# EAGLE schematic EnchantedCottage (EAGLE 7.2.0)
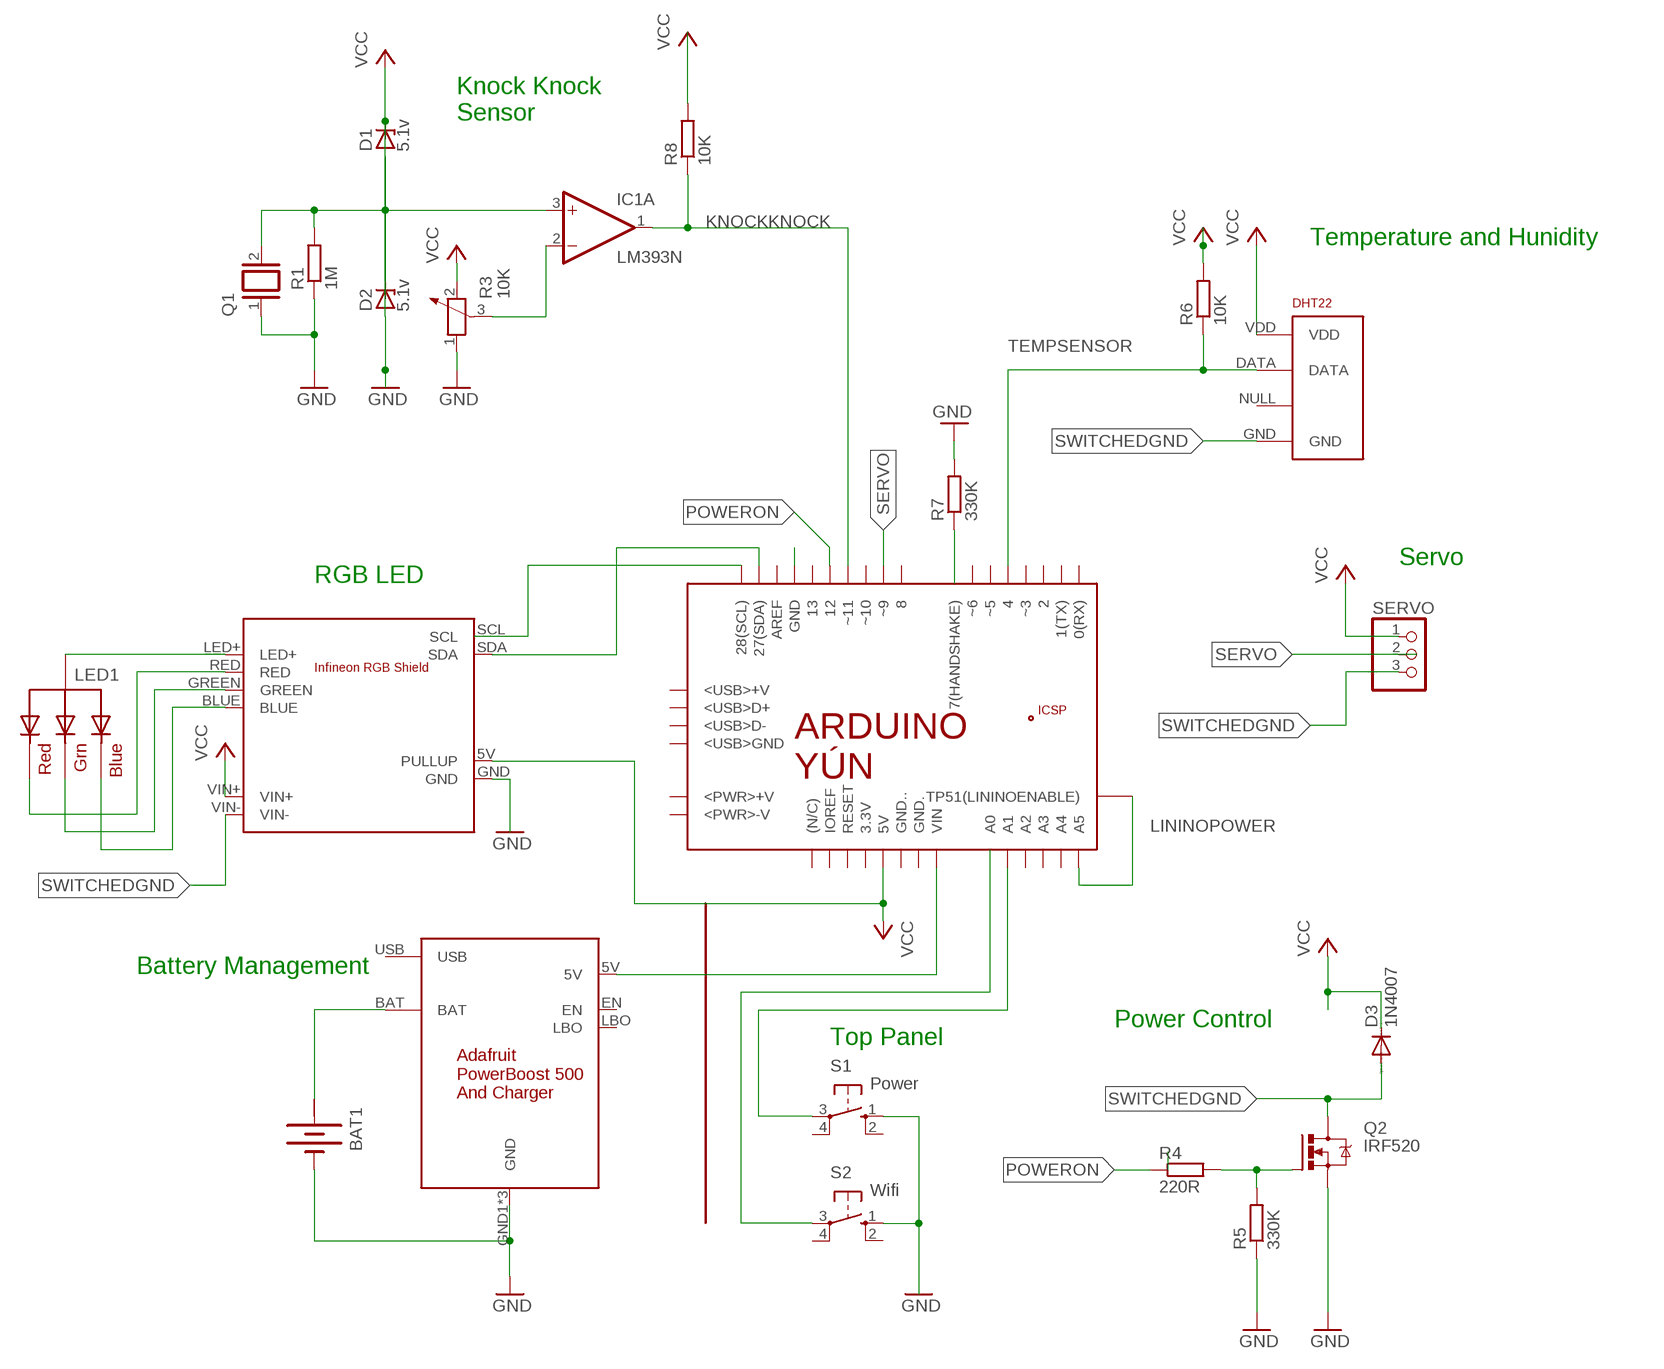
[diagram p0: schematic, sheet 1]

## Parts
BAT1  BATTERY  [BATTERY]
D1  5.1v  BZX55  [DO35Z10]
D2  5.1v  BZX55  [DO35Z10]
D3  1N4007  DIODE-C1702-15  [C1702-15]
DHT22  RHT03_DHT-22_AM2302  [RHT03_DHT-22]
IC1  LM393N  [DIL08]
LED1  RGBLED_CA-5MM  [LED5MMRGB]
PCB1  ARDUINO_YUN_EXT  (no package)
Q1  XTAL/S  [QS]
Q2  IRF520  [TO220BV]
R1  1M  R-EU_0204/7  [0204/7]
R3  10K  POTENTIOMETER_PT-10  [PT-10]
R4  220R  R-EU_0207/12  [0207/12]
R5  330K  R-EU_0207/12  [0207/12]
R6  10K  R-EU_0204/7  [0204/7]
R7  330K  R-EU_0204/7  [0204/7]
R8  10K  R-EU_0204/7  [0204/7]
S1  Power  10-XX  [B3F-10XX]
S2  Wifi  10-XX  [B3F-10XX]
SERVO  PINHD-1X3  [1X03]
U$1  POWERBOOST500  [PINS]
U$2  RGBSHIELD  [RGBSHIELD]

## Nets
GND: BAT1.- Q1.1 Q2.S R1.1 R3.1 R5.1 R7.2 S1.1(S) S2.1(S) U$1.GND1(GND) U$1.GND2(GND) U$1.GND3(GND)
KNOCKKNOCK: IC1.1(A:OUT) PCB1.~11 R8.1
LININOPOWER: PCB1.A5 PCB1.TP51(LININOENABLE)
N$1: IC1.2(A:-IN) R3.3
N$2: R7.1
N$3: D1.A D2.C IC1.3(A:+IN) Q1.2 R1.2
N$4: Q2.G R4.2 R5.2
N$5: PCB1.VIN U$1.5V
N$7: R6.2 ; supply symbol labelled VCC
N$8: BAT1.+ U$1.BAT
N$9: LED1.2(VCC) U$2.LED+
N$10: LED1.1(RED) U$2.RED
N$11: LED1.3(GREEN) U$2.GREEN
N$12: LED1.4(BLUE) U$2.BLUE
N$13: R8.2
N$14: U$2.GND
N$15: PCB1.27(SDA) U$2.SDA
N$16: PCB1.28(SCL)
N$17: PCB1.A1 S1.3(P)
N$18: PCB1.GND
N$19: S2.3(P)
POWERON: PCB1.12 R4.1
SERVO: PCB1.~9
SWITCHEDGND: D3.A DHT22.GND Q2.D SERVO.3
TEMPSENSOR: DHT22.DATA PCB1.4 R6.1
VCC: D1.C D2.A D3.C DHT22.VDD PCB1.5V R3.2 SERVO.1 U$2.5V(PULLUP) U$2.VIN+ ; supply symbol labelled GND
Unconnected: DHT22.NULL IC1.5(B:+IN) IC1.6(B:-IN) IC1.7(B:OUT) PCB1.0(RX) PCB1.1(TX) PCB1.2 PCB1.3.3V PCB1.7(HANDSHAKE) PCB1.8 PCB1.13 PCB1.(N/C) PCB1.+5V PCB1.<PWR>+V PCB1.<PWR>-V PCB1.<USB>+V PCB1.<USB>D+ PCB1.<USB>D- PCB1.<USB>GND PCB1.A0 PCB1.A2 PCB1.A3 PCB1.A4 PCB1.AREF PCB1.GND. PCB1.GND.. PCB1.GND_ PCB1.IOREF PCB1.MISO PCB1.MOSI PCB1.RESET PCB1.RESET. PCB1.SCK PCB1.~3 PCB1.~5 PCB1.~6 PCB1.~10 S1.2(S1) S1.4(P1) S2.2(S1) S2.4(P1) SERVO.2 U$1.EN U$1.LBO U$2.SCL

## Notes on the sheet
- Knock Knock
  Sensor
- Temperature and Hunidity
- Servo
- RGB LED
- Battery Management
- Power Control
- Top Panel

## Power pins joined to a net without a drawn wire
+: BAT1.+@1(+)
USB: U$1.USB
V+: IC1.8(P:V+)
V-: IC1.4(P:V-)
VIN-: U$2.VIN-

## Library data of the parts
BAT1 = special:BATTERY: BATTERY
D1 D2 = diode:BZX55: Z DIODE
D3 = diode:DIODE-: DIODE
DHT22 = RHT03_DHT-22_AM2302:RHT03_DHT-22_AM2302: RHT03 / DHT-22 / AM2302 Packages and symbol for the RHT03 / DHT-22 relative humidity and temperature sensor. Note: The AM2302 is a wired version of the DHT-22 which typically requires less clearance and is thus provided as a separate package.; PROD_ID: SEN-10167
IC1 = linear:LM393: COMPARATOR
LED1 = adafruit:RGBLED_CA: RGB LED, common-anode 5MM Staggered pins 5mm Piranha package http://www.ladyada.net/library/pcb/eaglelibrary.html
PCB1 = ArduinoYun:ARDUINO_YUN_EXT: Device for representing an Arduino Uno board in an EAGLE design without the PCB footprint. Created by Dave Young for Element14. More EAGLE documentation at: http://www.element14.com/community/community/knode/cadsoft_eagle
Q1 = special:XTAL/S: CRYSTAL
Q2 = transistor-power:IRF520: HEXFET Power MOSFET
R1 R4-R8 = resistor:R-EU_: RESISTOR, European symbol
R3 = rcl:POTENTIOMETER_: Potentiometer
S1 S2 = switch-omron:10-XX: OMRON SWITCH; MPN: B3F-1000; OC_FARNELL: 176432; OC_NEWARK: 36M3542
SERVO = adafruit:PINHD-1X3: PIN HEADER
U$1 = PowerBoost:POWERBOOST500: Adafruit Powerboost 500 + Charger
U$2 = InfineonShield:RGBSHIELD